# Altium schematic sheet Top.SchDoc: Top Schematic
size A4; Date: Not used; ApprovedBy: Not used; CheckedBy: Not used; Author: Not used; CompanyName: STMicroelectronics; DrawnBy: Not used; Engineer: Not used; Organization: Not used; Address1: Not used; Address2: Not used; Address3: Not used; Address4: Not used; DocumentNumber: Not used; Revision: Not used; SheetNumber: 2; SheetTotal: 7; CurrentTime: Not used; CurrentDate: Not used; Time: Not used; DocumentFullPathAndName: Not used; DocumentName: Not used; ModifiedDate: Not used; ImagePath: Not used; ProjectName: Not used; Application_BuildNumber: Not used
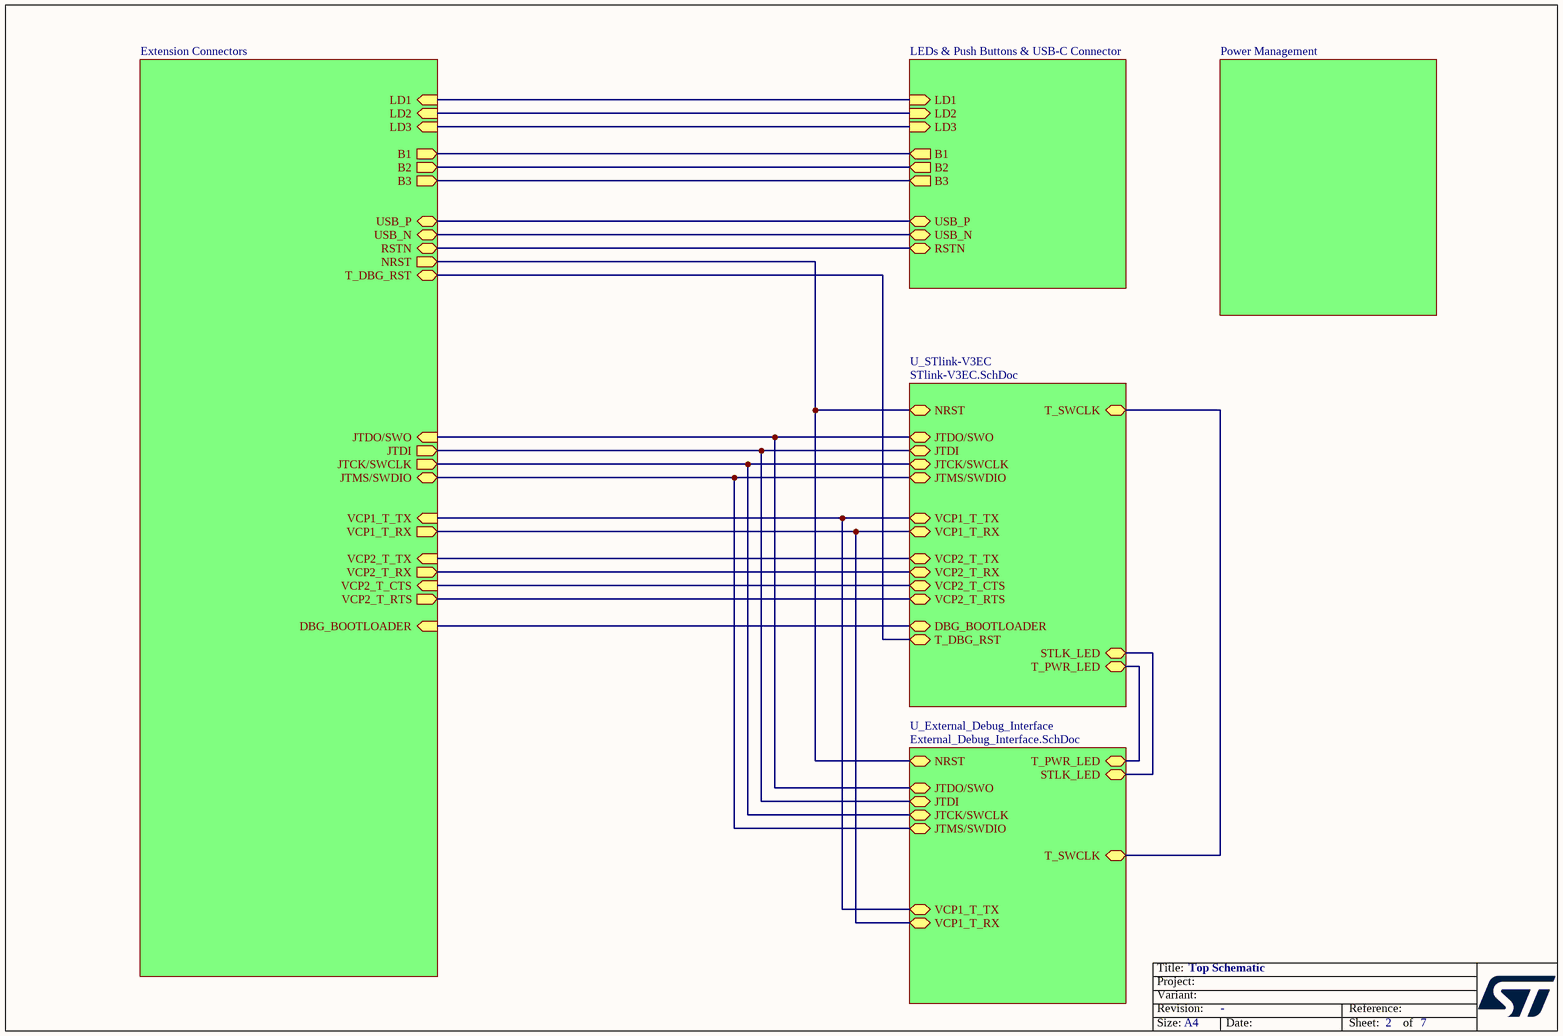
[diagram p0: Top.SchDoc]

## Sub-sheets
Extension Connectors = Extension_CN.SchDoc: JTMS/SWDIO (bidir), USB_P (bidir), USB_N (bidir), NRST (out), LD2 (in), LD3 (in), JTDI (out), B3 (out), B1 (out), JTDO/SWO (in), B2 (out), LD1 (in), DBG_BOOTLOADER (in), VCP1_T_RX (out), VCP2_T_CTS (in), VCP1_T_TX (in), VCP2_T_RX (out), VCP2_T_RTS (out), VCP2_T_TX (in), JTCK/SWCLK (out), T_DBG_RST (bidir), RSTN (bidir)
LEDs & Push Buttons & USB-C Connector = Accessories.SchDoc: LD1 (in), LD2 (in), LD3 (in), B1 (out), B2 (out), B3 (out), USB_P (bidir), USB_N (bidir), RSTN (bidir)
Power Management = Power_Management.SchDoc: no entries
U_External_Debug_Interface = External_Debug_Interface.SchDoc: JTDI (bidir), VCP1_T_TX (bidir), T_SWCLK (bidir), NRST (bidir), VCP1_T_RX (bidir), STLK_LED (bidir), T_PWR_LED (bidir), JTCK/SWCLK (bidir), JTMS/SWDIO (bidir), JTDO/SWO (bidir)
U_STlink-V3EC = STlink-V3EC.SchDoc: JTMS/SWDIO (bidir), JTDI (bidir), JTDO/SWO (bidir), NRST (bidir), DBG_BOOTLOADER (bidir), STLK_LED (bidir), VCP1_T_RX (bidir), VCP1_T_TX (bidir), T_PWR_LED (bidir), VCP2_T_RTS (bidir), VCP2_T_RX (bidir), VCP2_T_TX (bidir), T_SWCLK (bidir), VCP2_T_CTS (bidir), JTCK/SWCLK (bidir), T_DBG_RST (bidir)

## Nets
(unnamed): sheet Extension Connectors/JTMS/SWDIO, sheet U_STlink-V3EC/JTMS/SWDIO, sheet U_External_Debug_Interface/JTMS/SWDIO
(unnamed): sheet Extension Connectors/USB_P, sheet LEDs & Push Buttons & USB-C Connector/USB_P
(unnamed): sheet Extension Connectors/USB_N, sheet LEDs & Push Buttons & USB-C Connector/USB_N
(unnamed): sheet Extension Connectors/NRST, sheet U_STlink-V3EC/NRST, sheet U_External_Debug_Interface/NRST
(unnamed): sheet Extension Connectors/LD2, sheet LEDs & Push Buttons & USB-C Connector/LD2
(unnamed): sheet Extension Connectors/LD3, sheet LEDs & Push Buttons & USB-C Connector/LD3
(unnamed): sheet Extension Connectors/JTDI, sheet U_STlink-V3EC/JTDI, sheet U_External_Debug_Interface/JTDI
(unnamed): sheet Extension Connectors/B3, sheet LEDs & Push Buttons & USB-C Connector/B3
(unnamed): sheet Extension Connectors/B1, sheet LEDs & Push Buttons & USB-C Connector/B1
(unnamed): sheet Extension Connectors/JTDO/SWO, sheet U_STlink-V3EC/JTDO/SWO, sheet U_External_Debug_Interface/JTDO/SWO
(unnamed): sheet Extension Connectors/B2, sheet LEDs & Push Buttons & USB-C Connector/B2
(unnamed): sheet Extension Connectors/LD1, sheet LEDs & Push Buttons & USB-C Connector/LD1
(unnamed): sheet Extension Connectors/DBG_BOOTLOADER, sheet U_STlink-V3EC/DBG_BOOTLOADER
(unnamed): sheet Extension Connectors/VCP1_T_RX, sheet U_STlink-V3EC/VCP1_T_RX, sheet U_External_Debug_Interface/VCP1_T_RX
(unnamed): sheet Extension Connectors/VCP2_T_CTS, sheet U_STlink-V3EC/VCP2_T_CTS
(unnamed): sheet Extension Connectors/VCP1_T_TX, sheet U_STlink-V3EC/VCP1_T_TX, sheet U_External_Debug_Interface/VCP1_T_TX
(unnamed): sheet Extension Connectors/VCP2_T_RX, sheet U_STlink-V3EC/VCP2_T_RX
(unnamed): sheet Extension Connectors/VCP2_T_RTS, sheet U_STlink-V3EC/VCP2_T_RTS
(unnamed): sheet Extension Connectors/VCP2_T_TX, sheet U_STlink-V3EC/VCP2_T_TX
(unnamed): sheet Extension Connectors/JTCK/SWCLK, sheet U_STlink-V3EC/JTCK/SWCLK, sheet U_External_Debug_Interface/JTCK/SWCLK
(unnamed): sheet Extension Connectors/T_DBG_RST, sheet U_STlink-V3EC/T_DBG_RST
(unnamed): sheet Extension Connectors/RSTN, sheet LEDs & Push Buttons & USB-C Connector/RSTN
(unnamed): sheet U_STlink-V3EC/STLK_LED, sheet U_External_Debug_Interface/STLK_LED
(unnamed): sheet U_STlink-V3EC/T_PWR_LED, sheet U_External_Debug_Interface/T_PWR_LED
(unnamed): sheet U_STlink-V3EC/T_SWCLK, sheet U_External_Debug_Interface/T_SWCLK

## Notes on the sheet
- Title:
- Project:
- Size:
- Revision:
- Variant:
- A4
- -
- Date:
- Reference:
- Sheet:
- of